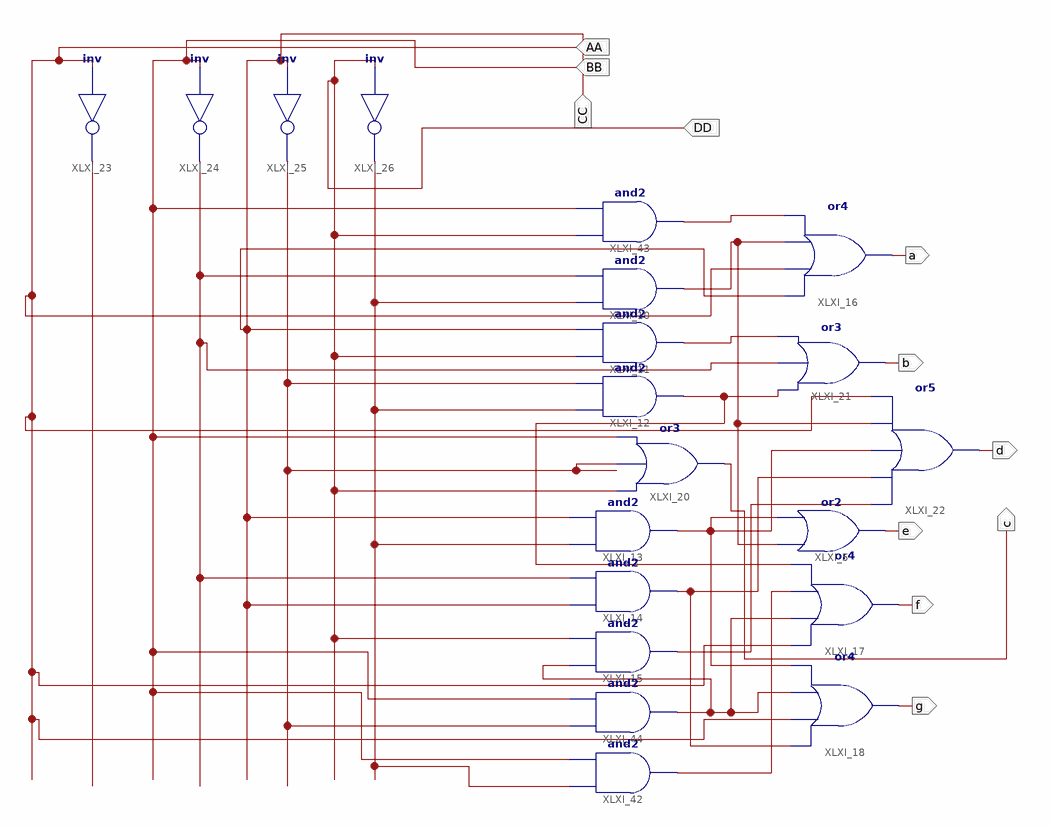
[diagram p0: schematic sheet 1]
// Xilinx ISE schematic seven_segment_circuit.sch (spartan6) as structural Verilog: 20 symbols, 11 ports
module seven_segment_circuit (
  input  BB,
  input  CC,
  input  DD,
  input  AA,
  output a,
  output b,
  output d,
  output c,
  output e,
  output f,
  output g
);

  wire XLXN_4, XLXN_10, XLXN_11, XLXN_13, XLXN_14, XLXN_16, XLXN_21, XLXN_24, XLXN_25, XLXN_27, XLXN_28,
       XLXN_29, XLXN_31;

  not XLXI_23 (XLXN_10, AA);
  not XLXI_24 (XLXN_11, BB);
  not XLXI_25 (XLXN_29, CC);
  not XLXI_26 (XLXN_13, DD);
  and XLXI_10 (XLXN_14, XLXN_13, XLXN_11);
  and XLXI_11 (XLXN_16, DD, CC);
  and XLXI_12 (XLXN_31, XLXN_13, XLXN_29);
  and XLXI_13 (XLXN_21, XLXN_13, CC);
  and XLXI_14 (XLXN_24, CC, XLXN_11);
  and XLXI_15 (XLXN_25, XLXN_28, DD);
  or XLXI_16 (a, CC, AA, XLXN_14, XLXN_4);
  or XLXI_17 (f, AA, XLXN_28, XLXN_27, XLXN_31);
  or XLXI_18 (g, XLXN_24, AA, XLXN_28, XLXN_21);
  or XLXI_20 (c, DD, XLXN_29, BB);
  or XLXI_21 (b, XLXN_31, XLXN_11, XLXN_16);
  or XLXI_5 (e, XLXN_14, XLXN_21);
  or XLXI_22 (d, XLXN_25, XLXN_24, XLXN_21, XLXN_14, AA);
  and XLXI_42 (XLXN_27, XLXN_13, BB);
  and XLXI_43 (XLXN_4, DD, BB);
  and XLXI_44 (XLXN_28, XLXN_29, BB);

  // Notes on the sheet:
  //   LOC on signal BB = P56
  //   LOC on signal CC = P57
  //   LOC on signal DD = P58
  //   LOC on signal a = P41
  //   LOC on signal b = P40
  //   LOC on signal d = P34
  //   LOC on signal c = P35
  //   LOC on signal e = P32
  //   LOC on signal f = P29
  //   LOC on signal g = P27
  //   LOC on signal AA = P55
endmodule
